# EAGLE design Breadboard_ProMicro_v3 (EAGLE 9.6.2)
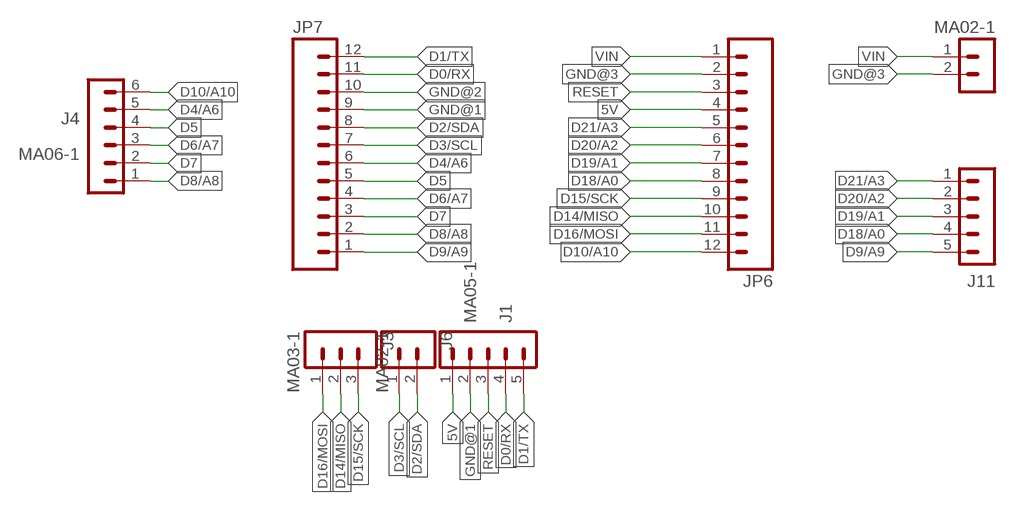
[diagram p0: schematic, sheet 1]

## Parts
J1  MA05-1  [MA05-1]
J3  MA03-1  [MA03-1]
J4  MA06-1  [MA06-1]
J6  MA02-1  [MA02-1]
J9  MA02-1  [MA02-1]
J11  MA05-1  [MA05-1]
JP6  M12PTH  [1X12]
JP7  M12PTH  [1X12]

## Nets
5V: J1.1 JP6.4
D0/RX: J1.4 JP7.11
D1/TX: J1.5 JP7.12
D2/SDA: J6.2 JP7.8
D3/SCL: J6.1 JP7.7
D4/A6: J4.5 JP7.6
D5: J4.4 JP7.5
D6/A7: J4.3 JP7.4
D7: J4.2 JP7.3
D8/A8: J4.1 JP7.2
D9/A9: J11.5 JP7.1
D10/A10: J4.6 JP6.12
D14/MISO: J3.2 JP6.10
D15/SCK: J3.3 JP6.9
D16/MOSI: J3.1 JP6.11
D18/A0: J11.4 JP6.8
D19/A1: J11.3 JP6.7
D20/A2: J11.2 JP6.6
D21/A3: J11.1 JP6.5
GND@1: J1.2 JP7.9
GND@2: JP7.10
GND@3 [vcc]: J9.2 JP6.2
RESET: J1.3 JP6.3
VIN: J9.1 JP6.1

## Library data of the parts
J1 J11 = 00_marph_CON_PinRows:MA05-1: Pin Header
J3 = 00_marph_connectors_IDC:MA03-1: Pin Header
J4 = 00_marph_CON_PinRows:MA06-1: Pin Header
J6 J9 = 00_marph_connectors_IDC:MA02-1: Pin Header
JP6 JP7 = SparkFun:M12: Header 12 Standard 12-pin 0.1" header. Use with straight break away headers (SKU : PRT-00116), right angle break away headers (PRT-00553), swiss pins (PRT-00743), machine pins (PRT-00117), and female headers (PRT-00115).

## Board
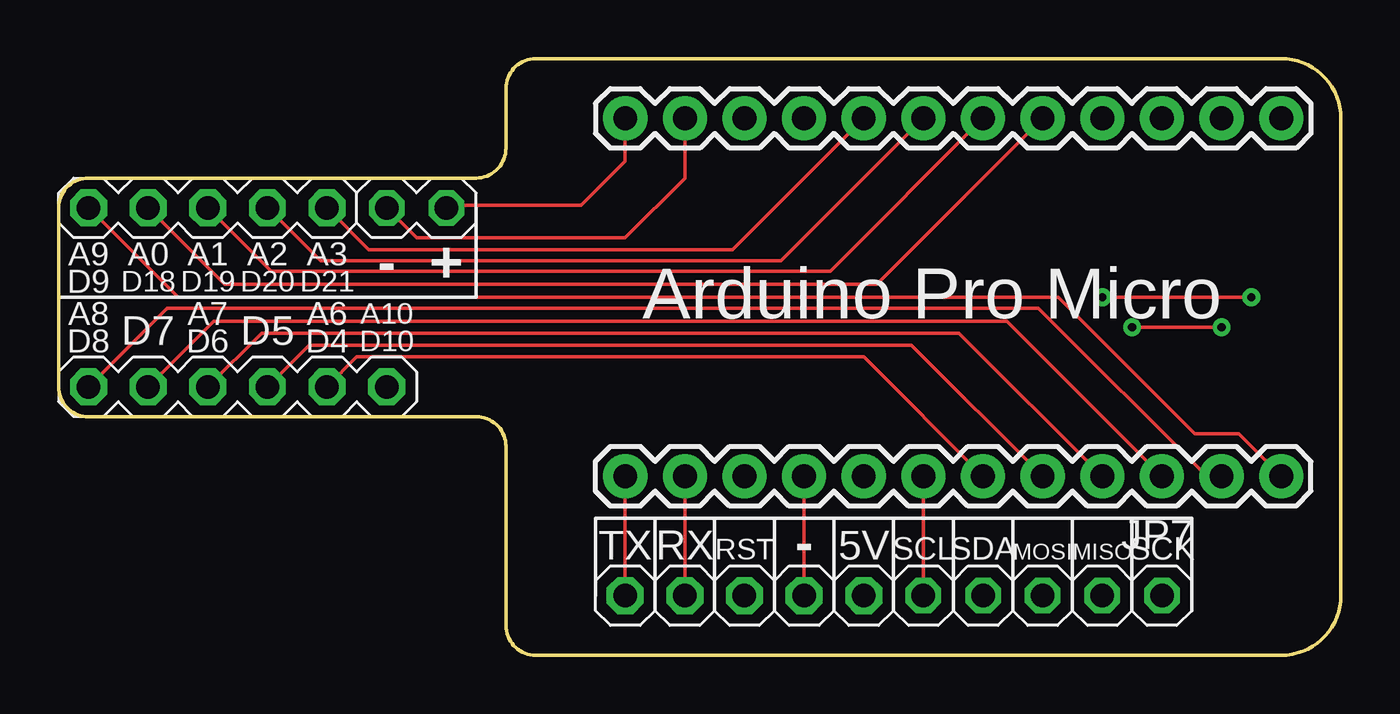
[diagram p1: board, top side]
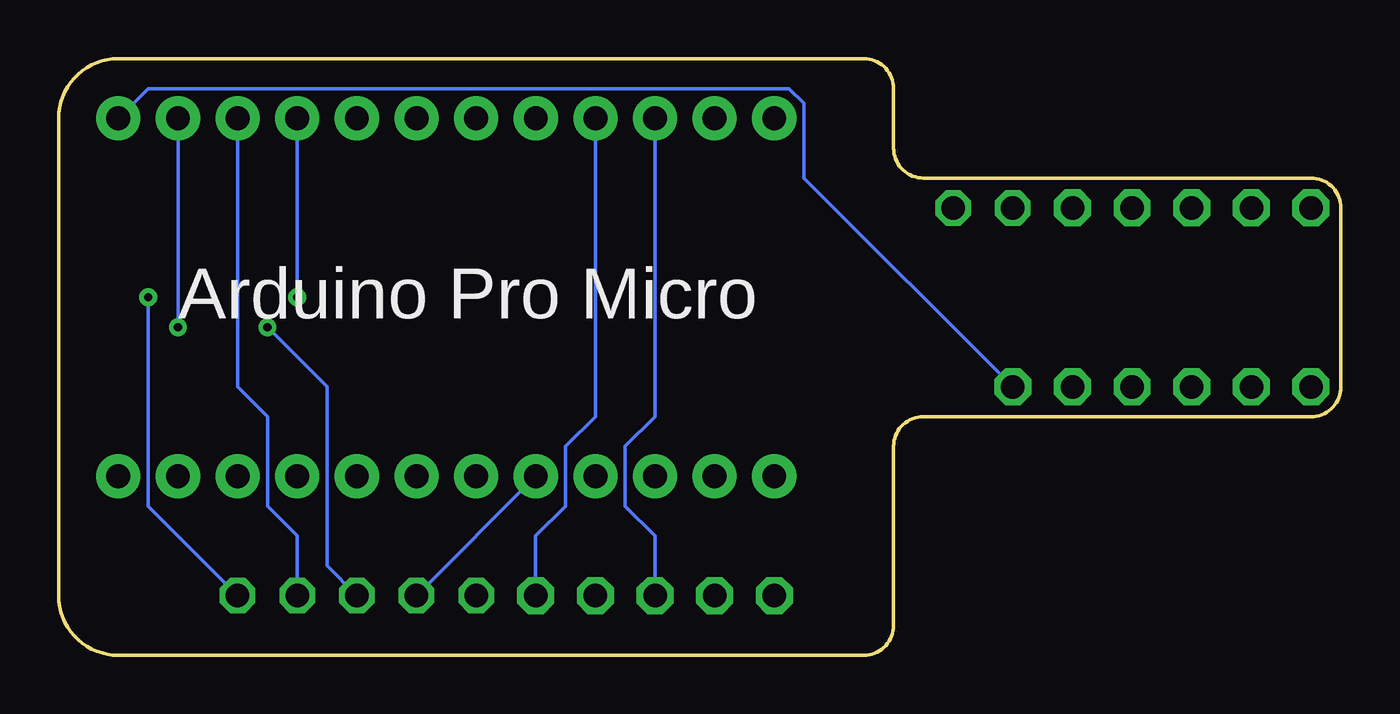
[diagram p2: board, bottom side, seen from below]

Size 54.61 x 25.4 mm. Coordinates in mm from the lower left corner, seen from the top.
Outline: 20.32,25.4 52.07,25.4 arc-90 54.61,22.86 54.61,2.54 arc-90 52.07,0 20.32,0 arc-90 19.05,1.27 19.05,8.89 arc90 17.78,10.16 1.27,10.16 arc-90 0,11.43 0,19.05 arc-90 1.27,20.32 17.78,20.32 arc90 19.05,21.59 19.05,24.13 arc-90 20.32,25.4
Copper layers (1*16): Top 0.035mm / dielectric 1.5mm / Bottom 0.035mm
Design rules "default": minimum track width 6mil, minimum drill 0.35mm, track to track 6mil, track to pad 6mil, pad to pad 6mil, via to via 6mil, smd to smd 6mil, copper to edge 40mil, drill to drill 6mil, minimum pad ring 10mil, minimum via ring 8mil, stop-mask expansion 4mil, vias tented up to drill 0mil, thermal gap 10mil

### Footprints (pad centres in the part's own frame; a part is rotated, then mirrored left to right if it is on the bottom)
MA05-1 = drill 1 pad 1.575 octagon: 1 0,5.08; 2 0,2.54; 3 0,0; 4 0,-2.54; 5 0,-5.08
MA03-1 = drill 1 octagon: 1 0,2.54; 2 0,0; 3 0,-2.54
MA06-1 = drill 1 pad 1.575 octagon: 1 0,6.35; 2 0,3.81; 3 0,1.27; 4 0,-1.27; 5 0,-3.81; 6 0,-6.35
MA02-1 = drill 1 octagon: 1 0,1.27; 2 0,-1.27
1X12 = drill 1.016 pad 1.88: 1 0,0; 2 2.54,0; 3 5.08,0; 4 7.62,0; 5 10.16,0; 6 12.7,0; 7 15.24,0; 8 17.78,0; 9 20.32,0; 10 22.86,0; 11 25.4,0; 12 27.94,0

### Placement (x,y rotation side)
J1  29.21,2.54 270 top
J3  44.45,2.54 90 top
J4  7.62,11.43 90 top
J6  38.1,2.54 90 top
J9  15.24,19.05 270 top
J11  6.35,19.05 270 top
JP6  24.13,22.86 0 top
JP7  52.07,7.62 180 top

### Tracks (layer width: path | path; a pad name or v marks a point on that pad's centre or on a via)
5V
  Bottom 0.152: JP6.4 31.75,10.16 33.02,8.89 33.02,6.35 34.29,5.08 J1.1
D0/RX
  Top 0.152: JP7.11 J1.4
D1/TX
  Top 0.152: JP7.12 J1.5
D2/SDA
  Bottom 0.152: JP7.8 J6.2
D3/SCL
  Top 0.152: J6.1 JP7.7
D4/A6
  Top 0.152: J4.5 12.7,12.7 34.29,12.7 JP7.6
D5
  Top 0.152: J4.4 10.67,13.21 36.32,13.21 JP7.5
D6/A7
  Top 0.152: J4.3 8.64,13.72 38.35,13.72 JP7.4
D7
  Top 0.152: J4.2 6.6,14.22 40.39,14.22 JP7.3
D8/A8
  Top 0.152: J4.1 4.62,14.78 41.73,14.78 48.9,7.62 JP7.2
D9/A9
  Top 0.152: JP7.1 50.26,9.43 48.39,9.43 42.58,15.24 5.08,15.24 J11.5
D10/A10
  Bottom 0.152: J4.6 22.86,20.32 22.86,23.5 23.5,24.13 50.8,24.13 JP6.12
D14/MISO
  Bottom 0.152: JP6.10 46.99,11.43 45.72,10.16 45.72,6.35 44.45,5.08 J3.2
D15/SCK  (via drill 0.35)
  Top 0.152: v50.8,15.24 v44.45,15.24
  Bottom 0.152: v50.8,15.24 50.8,6.35 J3.3 | JP6.9 v44.45,15.24
D16/MOSI  (via drill 0.35)
  Top 0.152: v45.72,13.97 v49.53,13.97
  Bottom 0.152: v45.72,13.97 43.18,11.43 43.18,3.81 J3.1 | JP6.11 v49.53,13.97
D18/A0
  Top 0.152: J11.4 7.06,15.8 34.85,15.8 JP6.8
D19/A1
  Top 0.152: J11.3 9.04,16.36 32.87,16.36 JP6.7
D20/A2
  Top 0.152: J11.2 11.15,16.79 30.76,16.79 JP6.6
D21/A3
  Top 0.152: J11.1 13.21,17.27 28.7,17.27 JP6.5
GND@1
  Top 0.152: JP7.9 J1.2
GND@3
  Top 0.152: J9.2 15.24,17.78 24.13,17.78 26.67,20.32 JP6.2
RESET
  Bottom 0.152: JP6.3 29.21,10.16 30.48,8.89 30.48,6.35 29.21,5.08 J1.3
VIN
  Top 0.152: J9.1 16.61,19.15 22.26,19.15 24.13,21.02 JP6.1

### Text on the board
tNames: A9 | A0 | A1 | A2 | A3 | - | + | Arduino Pro Micro | D9 | D18 | D19 | D20 | D21 | A8 | A7 | A6 | A10 | D8 | D7 | D6 | D5 | D4 | D10 | - | TX | RX | RST | 5V | SCL | SDA | MOSI | MISO | SCK
bNames: Arduino Pro Micro
Document: USB